# EAGLE design lora-rpi-hat-fab4space (EAGLE 6.5.0)
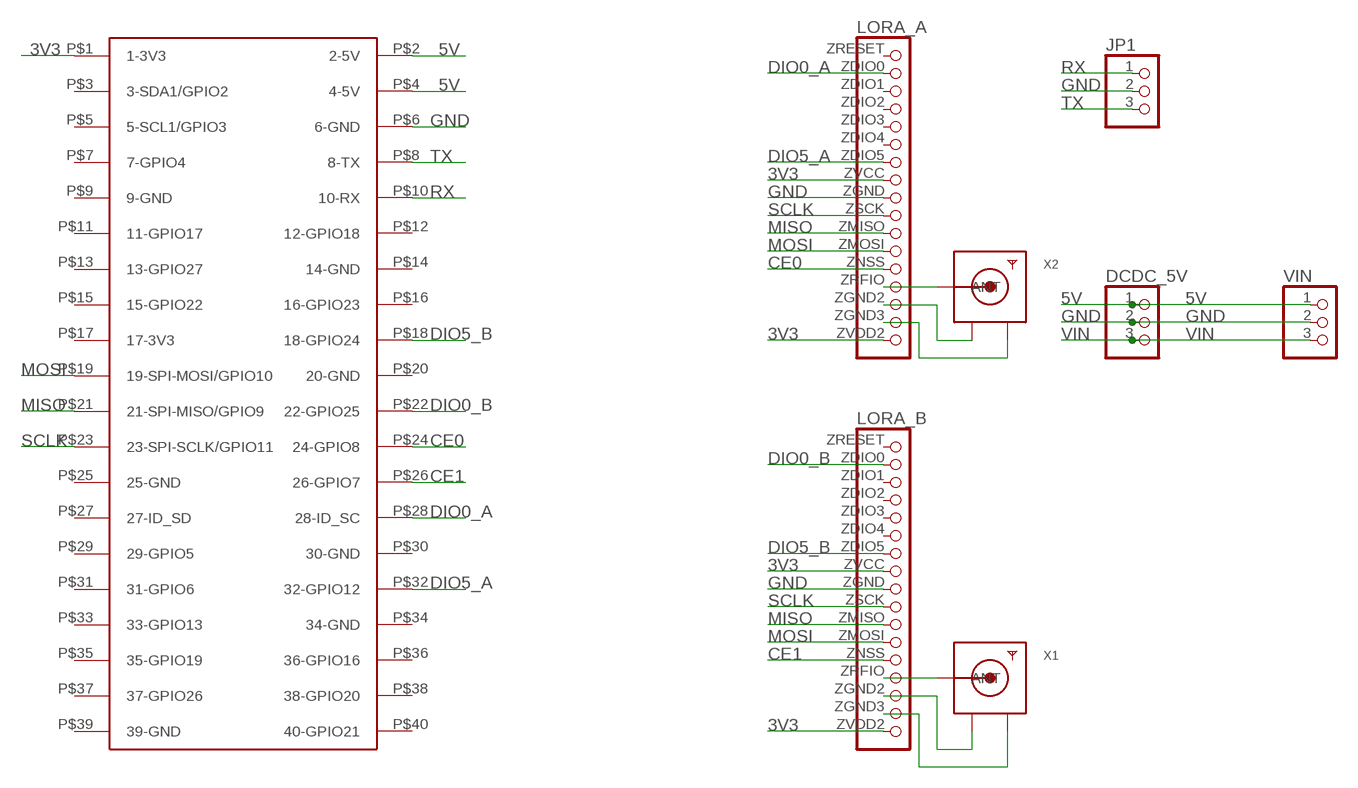
[diagram p0: schematic, sheet 1]

## Parts
DCDC_5V  PINHD-1X3  [1X03]
JP1  PINHD-1X3  [1X03]
LORA_A  DRF1278F_BKOUTDP1276  [ANYLINK_DP1276]
LORA_B  DRF1278F_BKOUTDP1276  [ANYLINK_DP1276]
U$1  RASPBERRY-PI+  [RASPBERRY-PI-PLUS-CAM_NOTCH]
VIN  PINHD-1X3  [1X03]
X1  SMACONNECTOR_EDGE  [SMA_EDGELAUNCH]
X2  SMACONNECTOR_EDGE  [SMA_EDGELAUNCH]

## Nets
3V3: LORA_A.ZVCC(VCC) LORA_A.ZVDD2(VCC2) LORA_B.ZVCC(VCC) LORA_B.ZVDD2(VCC2) U$1.P$1(1-3V3)
5V: DCDC_5V.1 U$1.P$2(2-5V) U$1.P$4(4-5V) VIN.1
CE0: LORA_A.ZNSS(NSS) U$1.P$24(24-GPIO8)
CE1: LORA_B.ZNSS(NSS) U$1.P$26(26-GPIO7)
DIO0_A: LORA_A.ZDIO0(DIO0) U$1.P$28(28-ID_SC)
DIO0_B: LORA_B.ZDIO0(DIO0) U$1.P$22(22-GPIO25)
DIO5_A: LORA_A.ZDIO5(DIO5) U$1.P$32(32-GPIO12)
DIO5_B: LORA_B.ZDIO5(DIO5) U$1.P$18(18-GPIO24)
GND: DCDC_5V.2 JP1.2 LORA_A.ZGND(GND) LORA_B.ZGND(GND) U$1.P$6(6-GND) VIN.2
MISO: LORA_A.ZMISO(MISO) LORA_B.ZMISO(MISO) U$1.P$21(21-SPI-MISO/GPIO9)
MOSI: LORA_A.ZMOSI(MOSI) LORA_B.ZMOSI(MOSI) U$1.P$19(19-SPI-MOSI/GPIO10)
N$1: LORA_A.ZRFIO(RFIO) X2.P(ANT)
N$2: LORA_A.ZGND2(RGND1) X2.GND@2(GND3)
N$3: LORA_A.ZGND3(RGND2) X2.GND@1(GND4)
N$4: LORA_B.ZRFIO(RFIO) X1.P(ANT)
N$5: LORA_B.ZGND2(RGND1) X1.GND@2(GND3)
N$6: LORA_B.ZGND3(RGND2) X1.GND@1(GND4)
RX: JP1.1 U$1.P$10(10-RX)
SCLK: LORA_A.ZSCK(SCK) LORA_B.ZSCK(SCK) U$1.P$23(23-SPI-SCLK/GPIO11)
TX: JP1.3 U$1.P$8(8-TX)
VIN: DCDC_5V.3 VIN.3
Unconnected: LORA_A.ZDIO1(DIO1) LORA_A.ZDIO2(DIO2) LORA_A.ZDIO3(DIO3) LORA_A.ZDIO4(DIO4) LORA_A.ZRESET(RESET) LORA_B.ZDIO1(DIO1) LORA_B.ZDIO2(DIO2) LORA_B.ZDIO3(DIO3) LORA_B.ZDIO4(DIO4) LORA_B.ZRESET(RESET) U$1.P$3(3-SDA1/GPIO2) U$1.P$5(5-SCL1/GPIO3) U$1.P$7(7-GPIO4) U$1.P$9(9-GND) U$1.P$11(11-GPIO17) U$1.P$12(12-GPIO18) U$1.P$13(13-GPIO27) U$1.P$14(14-GND) U$1.P$15(15-GPIO22) U$1.P$16(16-GPIO23) U$1.P$17(17-3V3) U$1.P$20(20-GND) U$1.P$25(25-GND) U$1.P$27(27-ID_SD) U$1.P$29(29-GPIO5) U$1.P$30(30-GND) U$1.P$31(31-GPIO6) U$1.P$33(33-GPIO13) U$1.P$34(34-GND) U$1.P$35(35-GPIO19) U$1.P$36(36-GPIO16) U$1.P$37(37-GPIO26) U$1.P$38(38-GPIO20) U$1.P$39(39-GND) U$1.P$40(40-GPIO21)

## Library data of the parts
DCDC_5V JP1 VIN = pinhead:PINHD-1X3: PIN HEADER
LORA_A LORA_B = adafruit:DRF1278F_BKOUT: PIN HEADER
U$1 = Ava:RASPBERRY-PI+: Samtec SSW-120-01-T-D
X1 X2 = adafruit:SMACONNECTOR: SMA Connector 90° DIP SMA Connector, 50 Ohm (4UConnector: 07259)

## Board
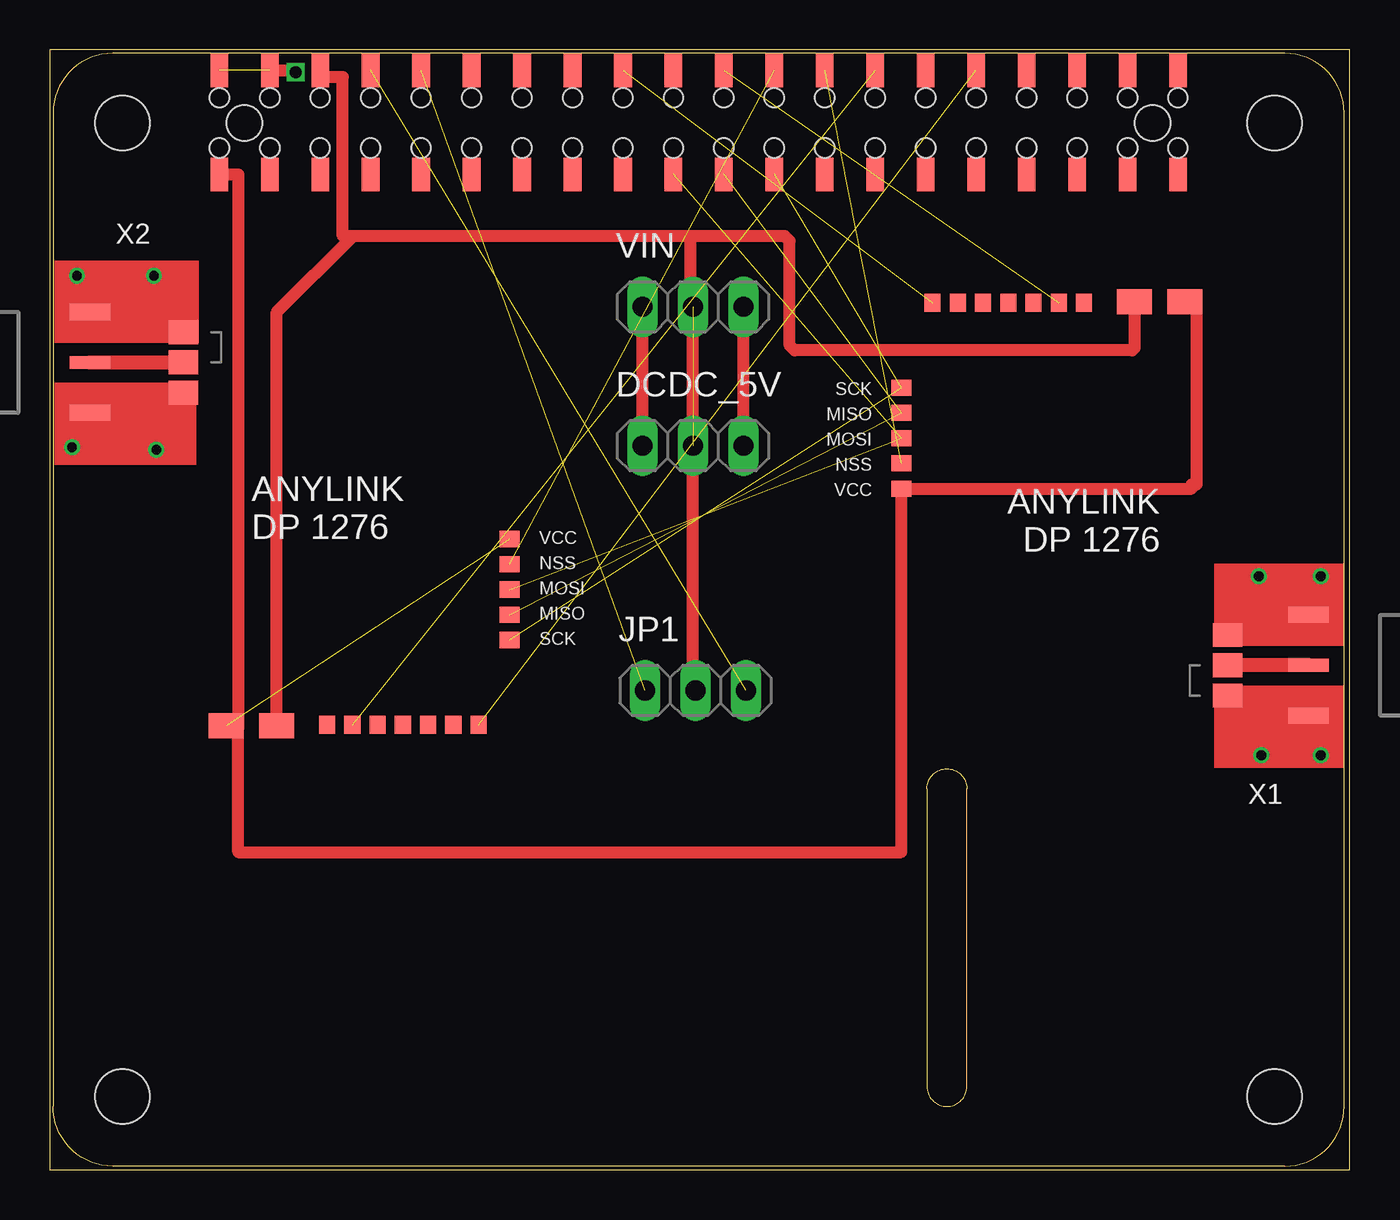
[diagram p1: board, top side]
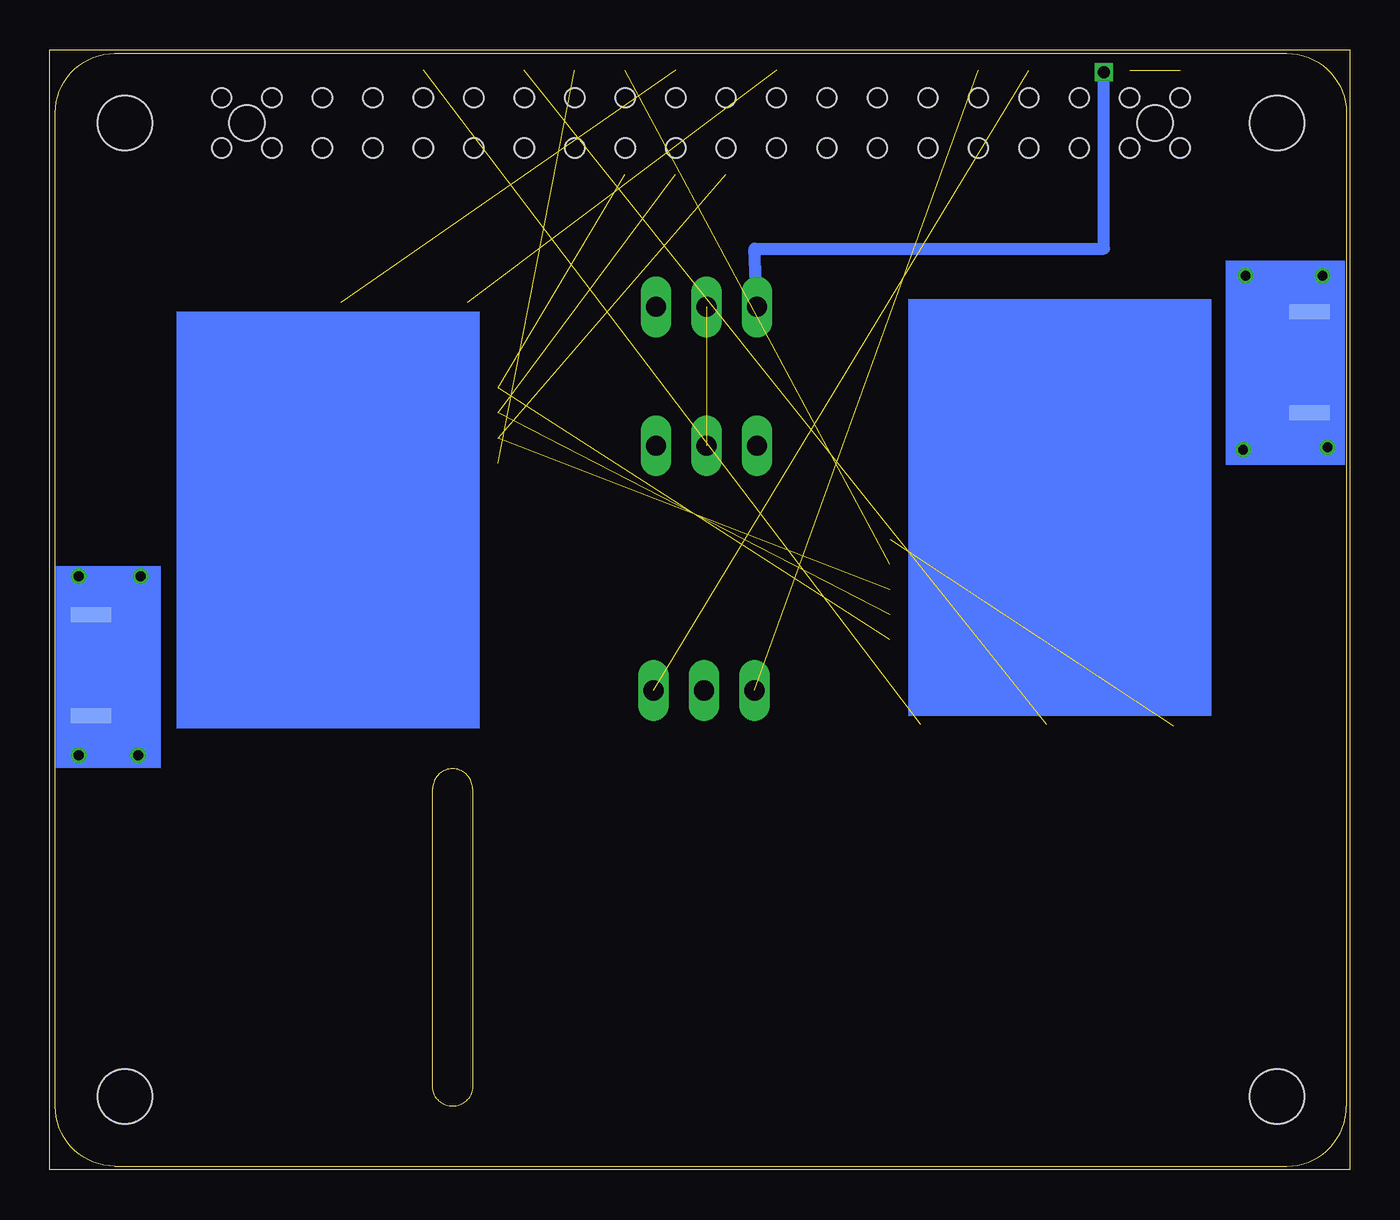
[diagram p2: board, bottom side, seen from below]

Size 65.46 x 56.38 mm. Coordinates in mm from the lower left corner, seen from the top.
Outline: 0,0 65.46,0 65.46,56.38 0,56.38 0,0
Copper layers (1*16): Top 0.035mm / dielectric 1.5mm / Bottom 0.035mm
Design rules "EagleRules": minimum track width 7mil, minimum drill 12mil, track to track 7mil, track to pad 7mil, pad to pad 7mil, via to via 7mil, smd to smd 0mil, copper to edge 20mil, drill to drill 10mil, minimum pad ring 10mil, minimum via ring 6mil, stop-mask expansion 2mil, vias tented up to drill 25mil, thermal gap 10mil

### Footprints (pad centres in the part's own frame; a part is rotated, then mirrored left to right if it is on the bottom)
1X03 = drill 1.016 long: 1 -2.54,0; 2 0,0; 3 2.54,0
ANYLINK_DP1276 = smd 0.813 x 0.914: ZDIO0 8.89,-22.047; ZDIO1 10.16,-22.047; ZDIO2 11.43,-22.047; ZDIO3 12.7,-22.047; ZDIO4 13.97,-22.047; ZDIO5 15.24,-22.047; ZRESET 7.62,-22.047 | smd 1.778 x 1.27: ZGND 5.08,-22.098; ZVCC 2.54,-22.098 | smd 1.5 x 1.2: ZGND2 0.389,-2.286; ZGND3 0.389,-5.334; ZRFIO 0.389,-3.81 | smd 1.016 x 0.813: ZMISO 16.81,-16.51; ZMOSI 16.81,-15.24; ZNSS 16.81,-13.97; ZSCK 16.81,-17.78; ZVDD2 16.81,-12.7
RASPBERRY-PI-PLUS-CAM_NOTCH = smd 0.889 x 1.68: P$1 -34.13,21.905; P$2 -34.13,27.145; P$3 -31.59,21.905; P$4 -31.59,27.145; P$5 -29.05,21.905; P$6 -29.05,27.145; P$7 -26.51,21.905; P$8 -26.51,27.145; P$9 -23.97,21.905; P$10 -23.97,27.145; P$11 -21.43,21.905; P$12 -21.43,27.145; P$13 -18.89,21.905; P$14 -18.89,27.145; P$15 -16.35,21.905; P$16 -16.35,27.145; P$17 -13.81,21.905; P$18 -13.81,27.145; P$19 -11.27,21.905; P$20 -11.27,27.145; P$21 -8.73,21.905; P$22 -8.73,27.145; P$23 -6.19,21.905; P$24 -6.19,27.145; P$25 -3.65,21.905; P$26 -3.65,27.145; P$27 -1.11,21.905; P$28 -1.11,27.145; P$29 1.43,21.905; P$30 1.43,27.145; P$31 3.97,21.905; P$32 3.97,27.145; P$33 6.51,21.905; P$34 6.51,27.145; P$35 9.05,21.905; P$36 9.05,27.145; P$37 11.59,21.905; P$38 11.59,27.145; P$39 14.13,21.905; P$40 14.13,27.145 | hole 2.75: -39,24.5; 19,24.5; -39,-24.5; 19,-24.5 | hole 1.78: -32.86,24.5; 12.86,24.5 | hole 0.97: -34.13,25.77; -31.59,25.77; -29.05,25.77; -26.51,25.77; -23.97,25.77; -21.43,25.77; -18.89,25.77; -16.35,25.77; -13.81,25.77; -11.27,25.77; -8.73,25.77; -6.19,25.77; -3.65,25.77; -1.11,25.77; 1.43,25.77; 3.97,25.77; 6.51,25.77; 9.05,25.77; 11.59,25.77; 14.13,25.77; -34.13,23.23; -31.59,23.23; -29.05,23.23; -26.51,23.23; -23.97,23.23; -21.43,23.23; -18.89,23.23; -16.35,23.23; -13.81,23.23; -11.27,23.23; -8.73,23.23; -6.19,23.23; -3.65,23.23; -1.11,23.23; 1.43,23.23; 3.97,23.23; 6.51,23.23; 9.05,23.23; 11.59,23.23; 14.13,23.23
SMA_EDGELAUNCH = smd 2.032 x 0.813: GND@1 2.032,-2.54; GND@2 2.032,2.54 | smd 2.032 x 0.762 bottom: GND@3 2.032,2.54; GND@4 2.032,-2.54 | smd 2.032 x 0.635: P 2.032,0

### Placement (x,y rotation side)
DCDC_5V  32.38,36.45 0 top
JP1  32.51,24.13 0 top
LORA_A  6.35,44.45 0 top
LORA_B  59.69,21.59 180 top
U$1  42.67,28.19 0 top
VIN  32.38,43.43 0 top
X1  65.41,25.4 180 top
X2  0,40.64 0 top

### Tracks (layer width: path | path; a pad name or v marks a point on that pad's centre or on a via)
3V3  (1 unrouted)
  Top 0.61: U$1.P$1 9.5,50.1 9.5,22.25 | 9.5,22.25 9.5,16 42.88,16 LORA_B.ZVDD2 57.5,34.29 57.5,34.5 57.75,34.5 57.75,43.75 57.21,43.75 LORA_B.ZVCC | 9.5,22.25 8.89,22.25 LORA_A.ZVCC
5V  (via drill 0.6)  (1 unrouted)
  Top 0.61: DCDC_5V.1 VIN.1 | U$1.P$4 12.25,55.34 v12.38,55.25
  Bottom 0.61: VIN.1 29.97,46.37 12.38,46.37 v12.38,55.25
CE0  (1 unrouted)
CE1  (1 unrouted)
DIO0_A  (1 unrouted)
DIO0_B  (1 unrouted)
DIO5_A  (1 unrouted)
DIO5_B  (1 unrouted)
GND  (1 unrouted)
  Top 0.61: JP1.2 32.38,24.13 VIN.2 32.25,43.43 32.25,47 | 32.25,47 15.25,47 | 15.25,47 14.75,47 14.75,55 13.62,55 U$1.P$6 | LORA_A.ZGND 11.43,43.18 15.25,47 | LORA_B.ZGND 54.61,41.36 54.5,41.25 37.5,41.25 37.25,41.5 37.25,46.75 37,47 32.25,47
MISO  (2 unrouted)
MOSI  (2 unrouted)
N$1
  Top 0.7: X2.P LORA_A.ZRFIO
N$2
  Top 0.7: LORA_A.ZGND2 2.03,42.16 X2.GND@2
N$3
  Top 0.7: LORA_A.ZGND3 2.03,39.12 X2.GND@1
N$4
  Top 0.7: X1.P LORA_B.ZRFIO
N$5
  Top 0.178: 63.25,22.86 X1.GND@2
  Top 0.7: LORA_B.ZGND2 63.25,23.88 63.25,22.86
N$6
  Top 0.178: 63.25,27.94 X1.GND@1
  Top 0.7: LORA_B.ZGND3 63.25,26.92 63.25,27.94
N$7  (via drill 0.5)
  other vias: 1.38,45
N$8  (via drill 0.5)
  other vias: 5.25,45
N$9  (via drill 0.5)
  other vias: 1.12,36.38
N$10  (via drill 0.5)
  other vias: 5.38,36.25
N$11  (via drill 0.5)
  other vias: 64,20.88
N$12  (via drill 0.5)
  other vias: 61,20.88
N$13  (via drill 0.5)
  other vias: 60.88,29.88
N$14  (via drill 0.5)
  other vias: 64,29.88
RX  (1 unrouted)
SCLK  (2 unrouted)
TX  (1 unrouted)
VIN
  Top 0.61: DCDC_5V.3 VIN.3
(copper drawn outside any net)
  shapes: Bottom area x4, Top area x4